# Altium schematic sheet voltageControl.SchDoc
size A4; SheetNumber: 1; SheetTotal: 2
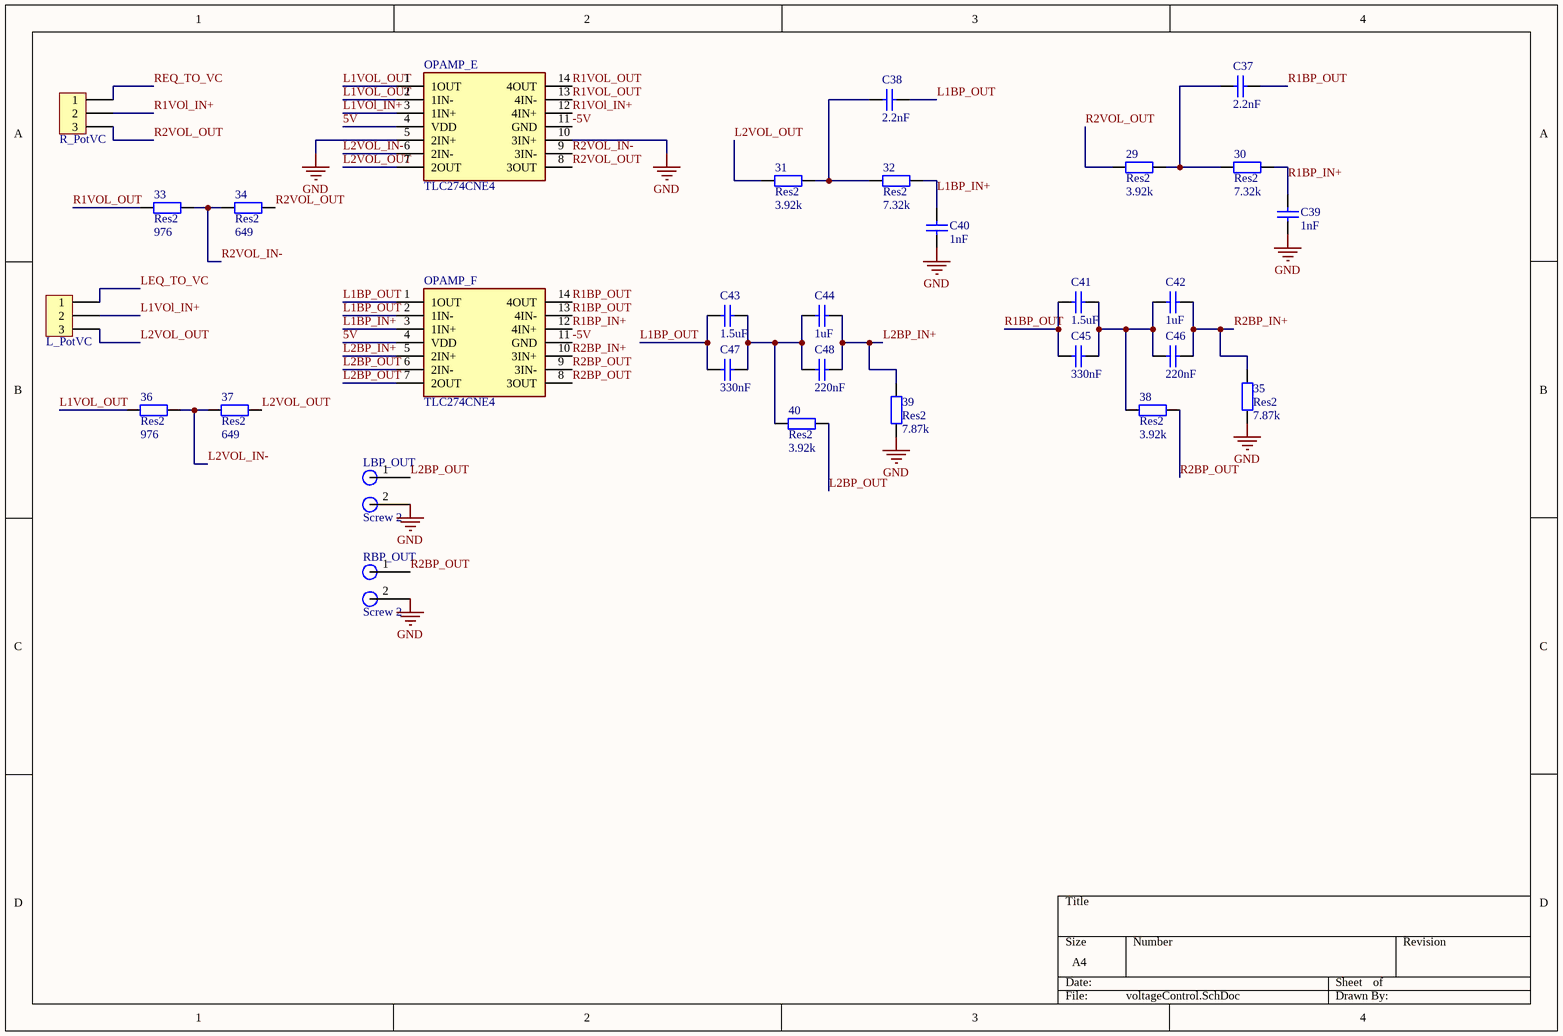
[diagram p0: voltageControl.SchDoc]

## Parts
29  Res2  value 3.92k  [AXIAL-0.4 PCBK]
30  Res2  value 7.32k  [AXIAL-0.4 PCBK]
31  Res2  value 3.92k  [AXIAL-0.4 PCBK]
32  Res2  value 7.32k  [AXIAL-0.4 PCBK]
33  Res2  value 976  [AXIAL-0.4 PCBK]
34  Res2  value 649  [AXIAL-0.4 PCBK]
35  Res2  value 7.87k  [AXIAL-0.4 PCBK]
36  Res2  value 976  [AXIAL-0.4 PCBK]
37  Res2  value 649  [AXIAL-0.4 PCBK]
38  Res2  value 3.92k  [AXIAL-0.4 PCBK]
39  Res2  value 7.87k  [AXIAL-0.4 PCBK]
40  Res2  value 3.92k  [AXIAL-0.4 PCBK]
C37  Capacity: 2.2nF  [Cap-1]  (hidden comment: Cap)
C38  Capacity: 2.2nF  [Cap-1]  (hidden comment: Cap)
C39  Capacity: 1nF  [Cap-1]  (hidden comment: Cap)
C40  Capacity: 1nF  [Cap-1]  (hidden comment: Cap)
C41  Capacity: 1.5uF  [Cap-1]  (hidden comment: Cap)
C42  Capacity: 1uF  [Cap-1]  (hidden comment: Cap)
C43  Capacity: 1.5uF  [Cap-1]  (hidden comment: Cap)
C44  Capacity: 1uF  [Cap-1]  (hidden comment: Cap)
C45  Capacity: 330nF  [Cap 20mm]  (hidden comment: Cap)
C46  Capacity: 220nF  [Cap-1]  (hidden comment: Cap)
C47  Capacity: 330nF  [Cap 20mm]  (hidden comment: Cap)
C48  Capacity: 220nF  [Cap-1]  (hidden comment: Cap)
L_PotVC  Header 1x3  [Header 1x3]  (value not drawn)
LBP_OUT  Screw 2  [Screw-2]
OPAMP_E  TLC274CNE4  [DIP794W53P254L1930H508Q14N]
OPAMP_F  TLC274CNE4  [DIP794W53P254L1930H508Q14N]
R_PotVC  Header 1x3  [Header 1x3]  (value not drawn)
RBP_OUT  Screw 2  [Screw-2]

## Nets
GND: 35.1 39.1 C39.1 C40.1 LBP_OUT.2 OPAMP_E.5(2IN+) OPAMP_E.10(3IN+) RBP_OUT.2
5V: OPAMP_E.4(VDD) OPAMP_F.4(VDD)
-5V: OPAMP_E.11(GND) OPAMP_F.11(GND)
L1BP_IN+: 32.2 C40.2(g) OPAMP_F.3(1IN+)
L1BP_OUT: C38.2(g) C43.1 C47.1 OPAMP_F.1(1OUT) OPAMP_F.2(1IN-)
L1VOl_IN+: L_PotVC.2 OPAMP_E.3(1IN+)
L1VOL_OUT: 36.1 OPAMP_E.1(1OUT) OPAMP_E.2(1IN-)
L2BP_IN+: 39.2 C44.2(g) C48.2(g) OPAMP_F.5(2IN+)
L2BP_OUT: 40.2 LBP_OUT.1 OPAMP_F.6(2IN-) OPAMP_F.7(2OUT)
L2VOL_IN-: 36.2 37.1 OPAMP_E.6(2IN-)
L2VOL_OUT: 31.1 37.2 L_PotVC.3 OPAMP_E.7(2OUT)
LEQ_TO_VC: L_PotVC.1
R1BP_IN+: 30.2 C39.2(g) OPAMP_F.12(4IN+)
R1BP_OUT: C37.2(g) C41.1 C45.1 OPAMP_F.13(4IN-) OPAMP_F.14(4OUT)
R1VOl_IN+: OPAMP_E.12(4IN+) R_PotVC.2
R1VOL_OUT: 33.1 OPAMP_E.13(4IN-) OPAMP_E.14(4OUT)
R2BP_IN+: 35.2 C42.2(g) C46.2(g) OPAMP_F.10(3IN+)
R2BP_OUT: 38.2 OPAMP_F.8(3OUT) OPAMP_F.9(3IN-) RBP_OUT.1
R2VOL_IN-: 33.2 34.1 OPAMP_E.9(3IN-)
R2VOL_OUT: 29.1 34.2 OPAMP_E.8(3OUT) R_PotVC.3
REQ_TO_VC: R_PotVC.1
Net29_2: 29.2 30.1 C37.1
Net31_2: 31.2 32.1 C38.1
Net38_1: 38.1 C41.2(g) C42.1 C45.2(g) C46.1
Net40_1: 40.1 C43.2(g) C44.1 C47.2(g) C48.1

## Library data of the parts
29-40 = Res PCBK: Resistor; Published: 8-Jun-2000; LatestRevisionDate: 17-Jul-2002; LatestRevisionNote: Re-released for DXP Platform.; PackageReference: AXIAL-0.4; Publisher: Altium Limited
C37-C44 C46 C48 = Capacitor 1 space
C45 C47 = Capacitor big ceramic
OPAMP_E OPAMP_F = TLC274CNE4: Precision Amplifiers Quad Single Supply Op Amp; Manufacturer_Name: Texas Instruments; Geometry.Height: 5.08mm; Mouser Part Number: 595-TLC274CNE4; Mouser Price/Stock: https://www.mouser.co.uk/ProductDetail/Texas-Instruments/TLC274CNE4?qs=Mkt%2FZhxPIiTvMsNXR1cCkw%3D%3D; Manufacturer_Part_Number: TLC274CNE4; Datasheet Link: https://www.ti.com/lit/ds/symlink/tlc274.pdf?ts=1639464334605&ref_url=https%253A%252F%252Fwww.ti.com%252Fstore%252Fti%252Fen%252Fp%252Fproduct%252F%253Fp%253DTLC274CN